# Altium schematic sheet DIMM Tester and Programmer.SchDoc
size A3
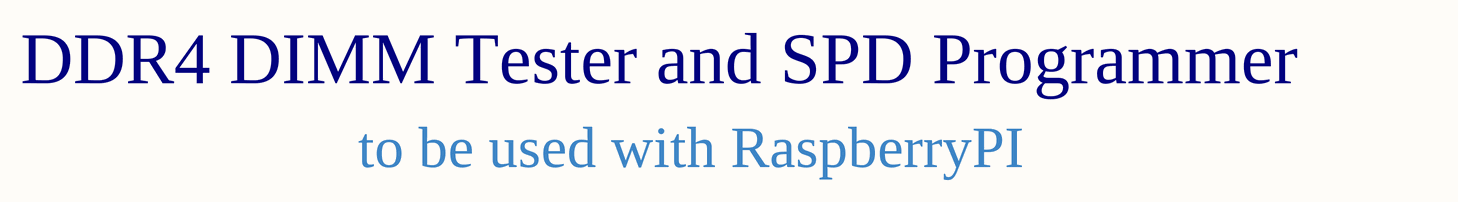
[diagram p0: DIMM Tester and Programmer.SchDoc]

## Notes on the sheet
- DDR4 DIMM Tester and SPD Programmer
- to be used with RaspberryPI